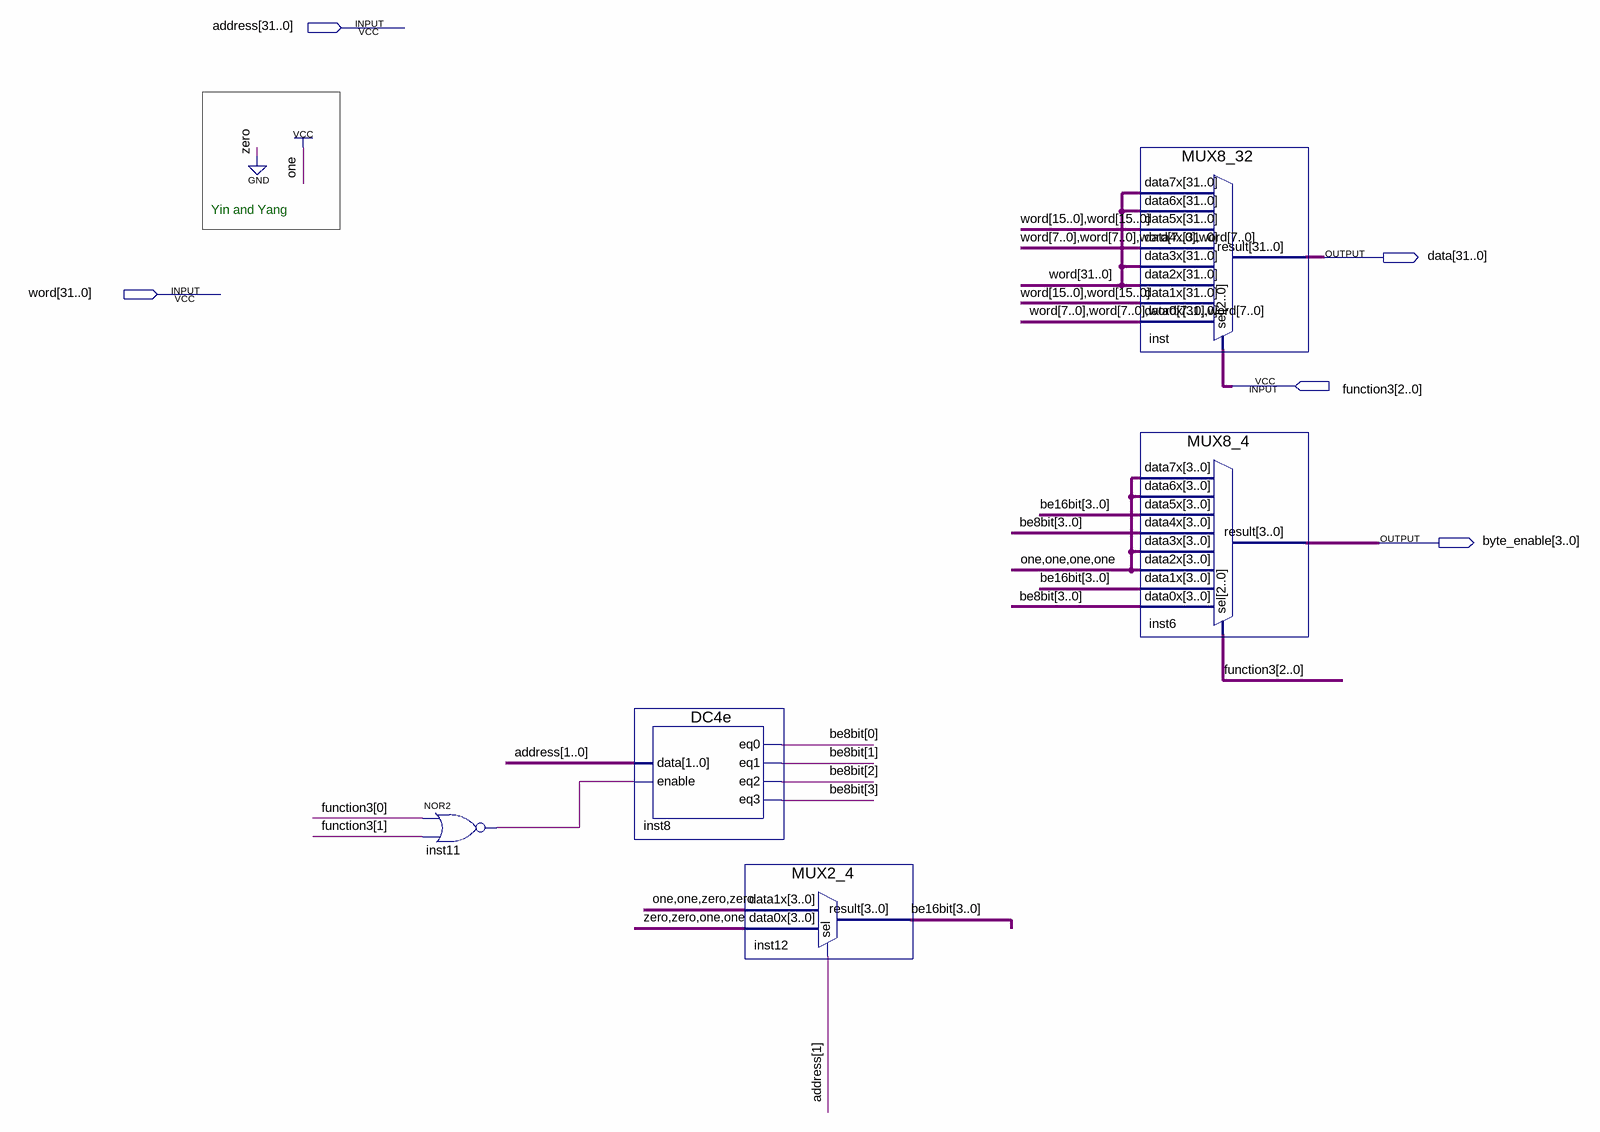
[diagram p0: schematic sheet]
// Quartus schematic StoreGenerator.bdf as structural Verilog: 5 symbols, 5 pins
module StoreGenerator (
  input  [31:0] address,
  input  [31:0] word,
  input  [2:0] function3,
  output [31:0] data,
  output [3:0] byte_enable
);

  wire inst11_out;
  wire [3:0] be8bit, be16bit;

  nor inst11 (inst11_out, function3[0], function3[1]);
  DC4e inst8 (
    .data(address[1:0]), .enable(inst11_out), .eq0(be8bit[0]), .eq1(be8bit[1]), .eq2(be8bit[2]),
    .eq3(be8bit[3]));
  MUX2_4 inst12 (.data1x(4'b1100), .data0x(4'b0011), .sel(address[1]), .result(be16bit));
  MUX8_32 inst (
    .data7x(word), .data6x(word), .data5x({word[15:0], word[15:0]}),
    .data4x({word[7:0], word[7:0], word[7:0], word[7:0]}), .data3x(word), .data2x(word),
    .data1x({word[15:0], word[15:0]}), .data0x({word[7:0], word[7:0], word[7:0], word[7:0]}),
    .sel(function3), .result(data));
  MUX8_4 inst6 (
    .data7x(4'b1111), .data6x(4'b1111), .data5x(be16bit), .data4x(be8bit), .data3x(4'b1111),
    .data2x(4'b1111), .data1x(be16bit), .data0x(be8bit), .sel(function3), .result(byte_enable));

  // Notes on the sheet:
  //   Yin and Yang
endmodule
